# Altium schematic sheet Sheet5.SchDoc
size A; SheetNumber: 4; SheetTotal: 4
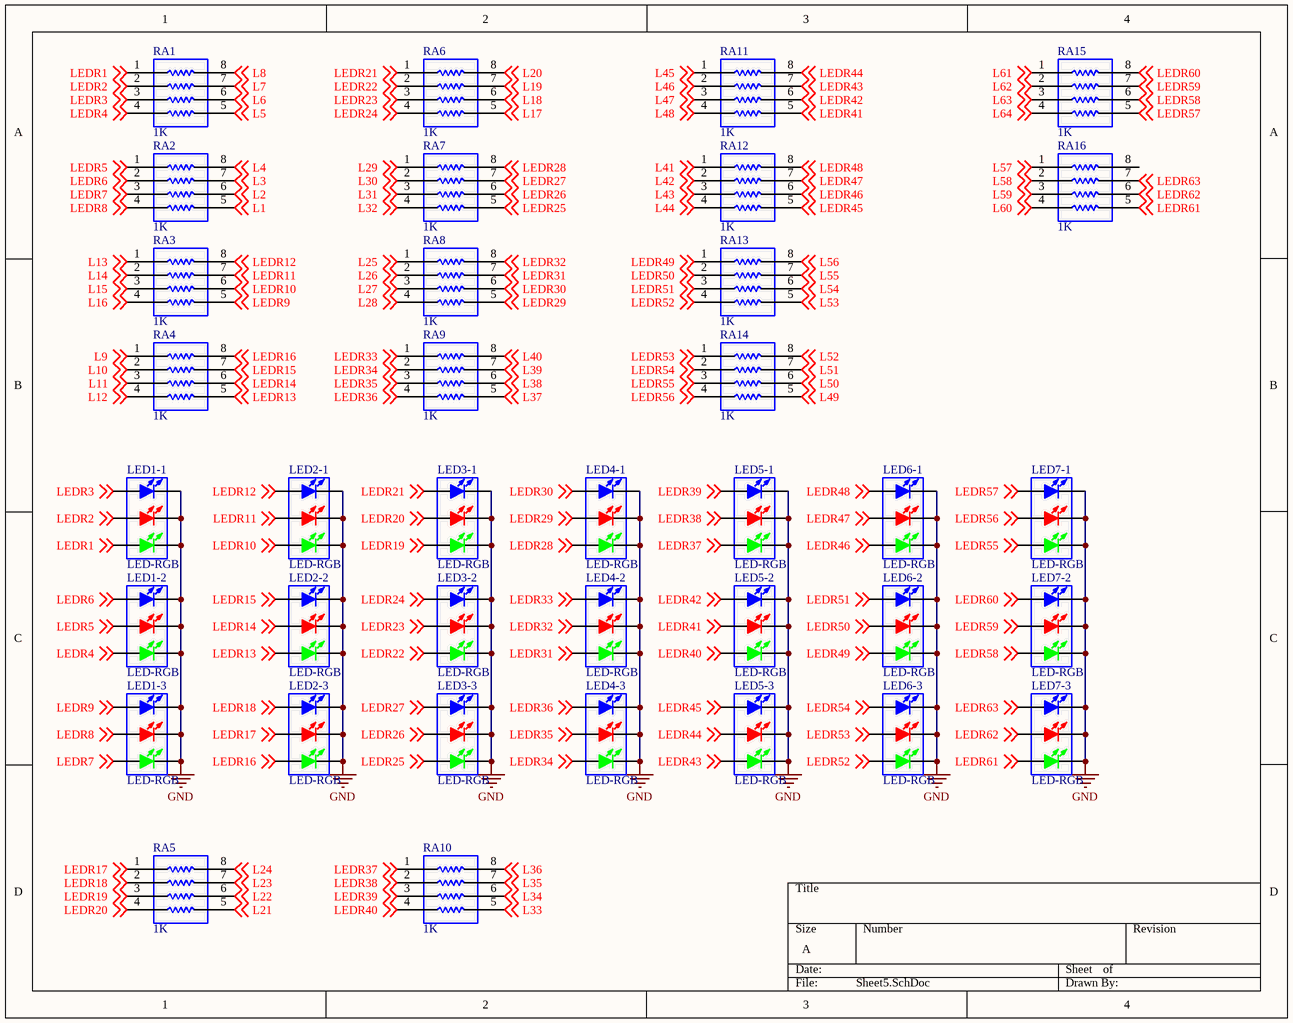
[diagram p0: Sheet5.SchDoc]

## Parts
LED1-1  LED-RGB  [LED 5050]
LED1-2  LED-RGB  [LED 5050]
LED1-3  LED-RGB  [LED 5050]
LED2-1  LED-RGB  [LED 5050]
LED2-2  LED-RGB  [LED 5050]
LED2-3  LED-RGB  [LED 5050]
LED3-1  LED-RGB  [LED 5050]
LED3-2  LED-RGB  [LED 5050]
LED3-3  LED-RGB  [LED 5050]
LED4-1  LED-RGB  [LED 5050]
LED4-2  LED-RGB  [LED 5050]
LED4-3  LED-RGB  [LED 5050]
LED5-1  LED-RGB  [LED 5050]
LED5-2  LED-RGB  [LED 5050]
LED5-3  LED-RGB  [LED 5050]
LED6-1  LED-RGB  [LED 5050]
LED6-2  LED-RGB  [LED 5050]
LED6-3  LED-RGB  [LED 5050]
LED7-1  LED-RGB  [LED 5050]
LED7-2  LED-RGB  [LED 5050]
LED7-3  LED-RGB  [LED 5050]
RA1  1K  [RA1206 (4x0603)]
RA2  1K  [RA1206 (4x0603)]
RA3  1K  [RA1206 (4x0603)]
RA4  1K  [RA1206 (4x0603)]
RA5  1K  [RA1206 (4x0603)]
RA6  1K  [RA1206 (4x0603)]
RA7  1K  [RA1206 (4x0603)]
RA8  1K  [RA1206 (4x0603)]
RA9  1K  [RA1206 (4x0603)]
RA10  1K  [RA1206 (4x0603)]
RA11  1K  [RA1206 (4x0603)]
RA12  1K  [RA1206 (4x0603)]
RA13  1K  [RA1206 (4x0603)]
RA14  1K  [RA1206 (4x0603)]
RA15  1K  [RA1206 (4x0603)]
RA16  1K  [RA1206 (4x0603)]

## Nets
GND: LED1-1.2(BULE_K) LED1-1.4(RED_K) LED1-1.6(GREEN_K) LED1-2.2(BULE_K) LED1-2.4(RED_K) LED1-2.6(GREEN_K) LED1-3.2(BULE_K) LED1-3.4(RED_K) LED1-3.6(GREEN_K) LED2-1.2(BULE_K) LED2-1.4(RED_K) LED2-1.6(GREEN_K) LED2-2.2(BULE_K) LED2-2.4(RED_K) LED2-2.6(GREEN_K) LED2-3.2(BULE_K) LED2-3.4(RED_K) LED2-3.6(GREEN_K) LED3-1.2(BULE_K) LED3-1.4(RED_K) LED3-1.6(GREEN_K) LED3-2.2(BULE_K) LED3-2.4(RED_K) LED3-2.6(GREEN_K) LED3-3.2(BULE_K) LED3-3.4(RED_K) LED3-3.6(GREEN_K) LED4-1.2(BULE_K) LED4-1.4(RED_K) LED4-1.6(GREEN_K) LED4-2.2(BULE_K) LED4-2.4(RED_K) LED4-2.6(GREEN_K) LED4-3.2(BULE_K) LED4-3.4(RED_K) LED4-3.6(GREEN_K) LED5-1.2(BULE_K) LED5-1.4(RED_K) LED5-1.6(GREEN_K) LED5-2.2(BULE_K) LED5-2.4(RED_K) LED5-2.6(GREEN_K) LED5-3.2(BULE_K) LED5-3.4(RED_K) LED5-3.6(GREEN_K) LED6-1.2(BULE_K) LED6-1.4(RED_K) LED6-1.6(GREEN_K) LED6-2.2(BULE_K) LED6-2.4(RED_K) LED6-2.6(GREEN_K) LED6-3.2(BULE_K) LED6-3.4(RED_K) LED6-3.6(GREEN_K) LED7-1.2(BULE_K) LED7-1.4(RED_K) LED7-1.6(GREEN_K) LED7-2.2(BULE_K) LED7-2.4(RED_K) LED7-2.6(GREEN_K) LED7-3.2(BULE_K) LED7-3.4(RED_K) LED7-3.6(GREEN_K)
L1: RA2.5 ; off-sheet L1
L2: RA2.6 ; off-sheet L2
L3: RA2.7 ; off-sheet L3
L4: RA2.8 ; off-sheet L4
L5: RA1.5 ; off-sheet L5
L6: RA1.6 ; off-sheet L6
L7: RA1.7 ; off-sheet L7
L8: RA1.8 ; off-sheet L8
L9: RA4.1 ; off-sheet L9
L10: RA4.2 ; off-sheet L10
L11: RA4.3 ; off-sheet L11
L12: RA4.4 ; off-sheet L12
L13: RA3.1 ; off-sheet L13
L14: RA3.2 ; off-sheet L14
L15: RA3.3 ; off-sheet L15
L16: RA3.4 ; off-sheet L16
L17: RA6.5 ; off-sheet L17
L18: RA6.6 ; off-sheet L18
L19: RA6.7 ; off-sheet L19
L20: RA6.8 ; off-sheet L20
L21: RA5.5 ; off-sheet L21
L22: RA5.6 ; off-sheet L22
L23: RA5.7 ; off-sheet L23
L24: RA5.8 ; off-sheet L24
L25: RA8.1 ; off-sheet L25
L26: RA8.2 ; off-sheet L26
L27: RA8.3 ; off-sheet L27
L28: RA8.4 ; off-sheet L28
L29: RA7.1 ; off-sheet L29
L30: RA7.2 ; off-sheet L30
L31: RA7.3 ; off-sheet L31
L32: RA7.4 ; off-sheet L32
L33: RA10.5 ; off-sheet L33
L34: RA10.6 ; off-sheet L34
L35: RA10.7 ; off-sheet L35
L36: RA10.8 ; off-sheet L36
L37: RA9.5 ; off-sheet L37
L38: RA9.6 ; off-sheet L38
L39: RA9.7 ; off-sheet L39
L40: RA9.8 ; off-sheet L40
L41: RA12.1 ; off-sheet L41
L42: RA12.2 ; off-sheet L42
L43: RA12.3 ; off-sheet L43
L44: RA12.4 ; off-sheet L44
L45: RA11.1 ; off-sheet L45
L46: RA11.2 ; off-sheet L46
L47: RA11.3 ; off-sheet L47
L48: RA11.4 ; off-sheet L48
L49: RA14.5 ; off-sheet L49
L50: RA14.6 ; off-sheet L50
L51: RA14.7 ; off-sheet L51
L52: RA14.8 ; off-sheet L52
L53: RA13.5 ; off-sheet L53
L54: RA13.6 ; off-sheet L54
L55: RA13.7 ; off-sheet L55
L56: RA13.8 ; off-sheet L56
L57: RA16.1 ; off-sheet L57
L58: RA16.2 ; off-sheet L58
L59: RA16.3 ; off-sheet L59
L60: RA16.4 ; off-sheet L60
L61: RA15.1 ; off-sheet L61
L62: RA15.2 ; off-sheet L62
L63: RA15.3 ; off-sheet L63
L64: RA15.4 ; off-sheet L64
LEDR1: LED1-1.5(GREEN_A) RA1.1 ; off-sheet LEDR1
LEDR2: LED1-1.3(RED_A) RA1.2 ; off-sheet LEDR2
LEDR3: LED1-1.1(BULE_A) RA1.3 ; off-sheet LEDR3
LEDR4: LED1-2.5(GREEN_A) RA1.4 ; off-sheet LEDR4
LEDR5: LED1-2.3(RED_A) RA2.1 ; off-sheet LEDR5
LEDR6: LED1-2.1(BULE_A) RA2.2 ; off-sheet LEDR6
LEDR7: LED1-3.5(GREEN_A) RA2.3 ; off-sheet LEDR7
LEDR8: LED1-3.3(RED_A) RA2.4 ; off-sheet LEDR8
LEDR9: LED1-3.1(BULE_A) RA3.5 ; off-sheet LEDR9
LEDR10: LED2-1.5(GREEN_A) RA3.6 ; off-sheet LEDR10
LEDR11: LED2-1.3(RED_A) RA3.7 ; off-sheet LEDR11
LEDR12: LED2-1.1(BULE_A) RA3.8 ; off-sheet LEDR12
LEDR13: LED2-2.5(GREEN_A) RA4.5 ; off-sheet LEDR13
LEDR14: LED2-2.3(RED_A) RA4.6 ; off-sheet LEDR14
LEDR15: LED2-2.1(BULE_A) RA4.7 ; off-sheet LEDR15
LEDR16: LED2-3.5(GREEN_A) RA4.8 ; off-sheet LEDR16
LEDR17: LED2-3.3(RED_A) RA5.1 ; off-sheet LEDR17
LEDR18: LED2-3.1(BULE_A) RA5.2 ; off-sheet LEDR18
LEDR19: LED3-1.5(GREEN_A) RA5.3 ; off-sheet LEDR19
LEDR20: LED3-1.3(RED_A) RA5.4 ; off-sheet LEDR20
LEDR21: LED3-1.1(BULE_A) RA6.1 ; off-sheet LEDR21
LEDR22: LED3-2.5(GREEN_A) RA6.2 ; off-sheet LEDR22
LEDR23: LED3-2.3(RED_A) RA6.3 ; off-sheet LEDR23
LEDR24: LED3-2.1(BULE_A) RA6.4 ; off-sheet LEDR24
LEDR25: LED3-3.5(GREEN_A) RA7.5 ; off-sheet LEDR25
LEDR26: LED3-3.3(RED_A) RA7.6 ; off-sheet LEDR26
LEDR27: LED3-3.1(BULE_A) RA7.7 ; off-sheet LEDR27
LEDR28: LED4-1.5(GREEN_A) RA7.8 ; off-sheet LEDR28
LEDR29: LED4-1.3(RED_A) RA8.5 ; off-sheet LEDR29
LEDR30: LED4-1.1(BULE_A) RA8.6 ; off-sheet LEDR30
LEDR31: LED4-2.5(GREEN_A) RA8.7 ; off-sheet LEDR31
LEDR32: LED4-2.3(RED_A) RA8.8 ; off-sheet LEDR32
LEDR33: LED4-2.1(BULE_A) RA9.1 ; off-sheet LEDR33
LEDR34: LED4-3.5(GREEN_A) RA9.2 ; off-sheet LEDR34
LEDR35: LED4-3.3(RED_A) RA9.3 ; off-sheet LEDR35
LEDR36: LED4-3.1(BULE_A) RA9.4 ; off-sheet LEDR36
LEDR37: LED5-1.5(GREEN_A) RA10.1 ; off-sheet LEDR37
LEDR38: LED5-1.3(RED_A) RA10.2 ; off-sheet LEDR38
LEDR39: LED5-1.1(BULE_A) RA10.3 ; off-sheet LEDR39
LEDR40: LED5-2.5(GREEN_A) RA10.4 ; off-sheet LEDR40
LEDR41: LED5-2.3(RED_A) RA11.5 ; off-sheet LEDR41
LEDR42: LED5-2.1(BULE_A) RA11.6 ; off-sheet LEDR42
LEDR43: LED5-3.5(GREEN_A) RA11.7 ; off-sheet LEDR43
LEDR44: LED5-3.3(RED_A) RA11.8 ; off-sheet LEDR44
LEDR45: LED5-3.1(BULE_A) RA12.5 ; off-sheet LEDR45
LEDR46: LED6-1.5(GREEN_A) RA12.6 ; off-sheet LEDR46
LEDR47: LED6-1.3(RED_A) RA12.7 ; off-sheet LEDR47
LEDR48: LED6-1.1(BULE_A) RA12.8 ; off-sheet LEDR48
LEDR49: LED6-2.5(GREEN_A) RA13.1 ; off-sheet LEDR49
LEDR50: LED6-2.3(RED_A) RA13.2 ; off-sheet LEDR50
LEDR51: LED6-2.1(BULE_A) RA13.3 ; off-sheet LEDR51
LEDR52: LED6-3.5(GREEN_A) RA13.4 ; off-sheet LEDR52
LEDR53: LED6-3.3(RED_A) RA14.1 ; off-sheet LEDR53
LEDR54: LED6-3.1(BULE_A) RA14.2 ; off-sheet LEDR54
LEDR55: LED7-1.5(GREEN_A) RA14.3 ; off-sheet LEDR55
LEDR56: LED7-1.3(RED_A) RA14.4 ; off-sheet LEDR56
LEDR57: LED7-1.1(BULE_A) RA15.5 ; off-sheet LEDR57
LEDR58: LED7-2.5(GREEN_A) RA15.6 ; off-sheet LEDR58
LEDR59: LED7-2.3(RED_A) RA15.7 ; off-sheet LEDR59
LEDR60: LED7-2.1(BULE_A) RA15.8 ; off-sheet LEDR60
LEDR61: LED7-3.5(GREEN_A) RA16.5 ; off-sheet LEDR61
LEDR62: LED7-3.3(RED_A) RA16.6 ; off-sheet LEDR62
LEDR63: LED7-3.1(BULE_A) RA16.7 ; off-sheet LEDR63

Not connected (* = marked no-connect by the designer): RA16 8

## Library data of the parts
LED1-1-LED1-3 LED2-1-LED2-3 LED3-1-LED3-3 LED4-1-LED4-3 LED5-1-LED5-3 LED6-1-LED6-3 LED7-1-LED7-3 = LED-RGB: Three primary color LED; BOM名称: 三基色LED; 版权归属: 源创客; 学习资源: www.ooocke.com
RA1-RA16 = R-ARR: 4 way Chip Resistor Array